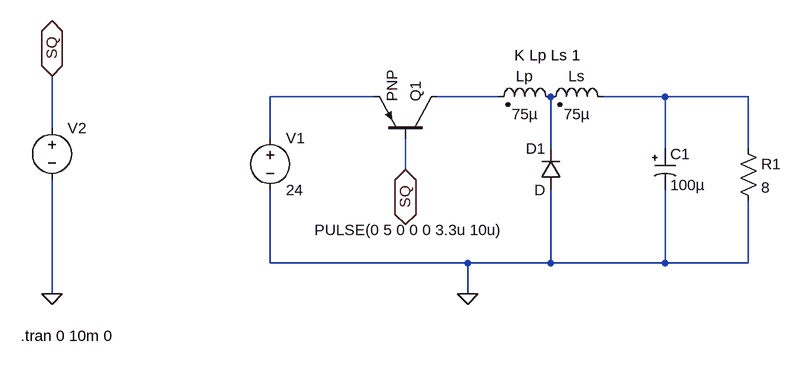
[diagram p0: schematic Fuente Tapped Ind.asc]
Fuente Tapped Ind.asc, the LTspice schematic file:
Version 4
SHEET 1 1720 788
WIRE -64 16 -224 16
WIRE 128 16 32 16
WIRE 384 16 288 16
WIRE 512 16 384 16
WIRE -560 64 -560 -16
WIRE -224 80 -224 16
WIRE 208 96 208 16
WIRE 384 96 384 16
WIRE 512 96 512 16
WIRE -16 128 -16 80
WIRE -224 272 -224 160
WIRE 80 272 -224 272
WIRE 208 272 208 160
WIRE 208 272 80 272
WIRE 384 272 384 160
WIRE 384 272 208 272
WIRE 512 272 512 176
WIRE 512 272 384 272
WIRE -560 320 -560 144
WIRE 80 320 80 272
FLAG 80 320 0
FLAG -16 128 SQ
IOPIN -16 128 BiDir
FLAG -560 -16 SQ
IOPIN -560 -16 BiDir
FLAG -560 320 0
SYMBOL ind2 224 32 M270
WINDOW 0 32 56 VTop 2
WINDOW 3 5 56 VBottom 2
SYMATTR InstName Lp
SYMATTR Value 75µ
SYMATTR Type ind
SYMBOL ind2 304 32 M270
WINDOW 0 32 56 VTop 2
WINDOW 3 5 56 VBottom 2
SYMATTR InstName Ls
SYMATTR Value 75µ
SYMATTR Type ind
SYMBOL voltage -224 64 R0
WINDOW 123 0 0 Left 0
WINDOW 39 0 0 Left 0
SYMATTR InstName V1
SYMATTR Value 24
SYMBOL voltage -560 48 R0
WINDOW 123 0 0 Left 0
WINDOW 39 0 0 Left 0
WINDOW 3 404 173 Left 2
SYMATTR InstName V2
SYMATTR Value PULSE(0 5 0 0 0 3.3u 10u)
SYMBOL pnp 32 80 M270
SYMATTR InstName Q1
SYMBOL polcap 368 96 R0
WINDOW 3 24 56 Left 2
SYMATTR Value 100µ
SYMATTR InstName C1
SYMATTR Description Capacitor
SYMATTR Type cap
SYMBOL res 496 80 R0
SYMATTR InstName R1
SYMATTR Value 8
SYMBOL diode 224 160 R180
WINDOW 0 24 64 Left 2
WINDOW 3 24 0 Left 2
SYMATTR InstName D1
TEXT -608 384 Left 2 !.tran 0 10m 0
TEXT 152 -48 Left 2 !K Lp Ls 1

The netlist it stands for:
* Fuente Tapped Ind.asc
Lp N004 N002 75µ
Ls N003 N004 75µ
V1 N001 0 24
V2 SQ 0 PULSE(0 5 0 0 0 3.3u 10u)
Q1 N002 SQ N001 0 PNP
C1 N003 0 100µ
R1 N003 0 8
D1 0 N004 D
.model D D
.lib standard.dio
.model NPN NPN
.model PNP PNP
.lib standard.bjt
.tran 0 10m 0
K Lp Ls 1
.backanno
.end